# Altium schematic sheet Whitespace_Daughtercard_uhf.SchDoc: UHF 470-800 MHz Matching, PA Chain, TX/RX Switching
size D; Author: Ryan E. Guerra; Revision: 1.5; SheetNumber: 7; SheetTotal: 10
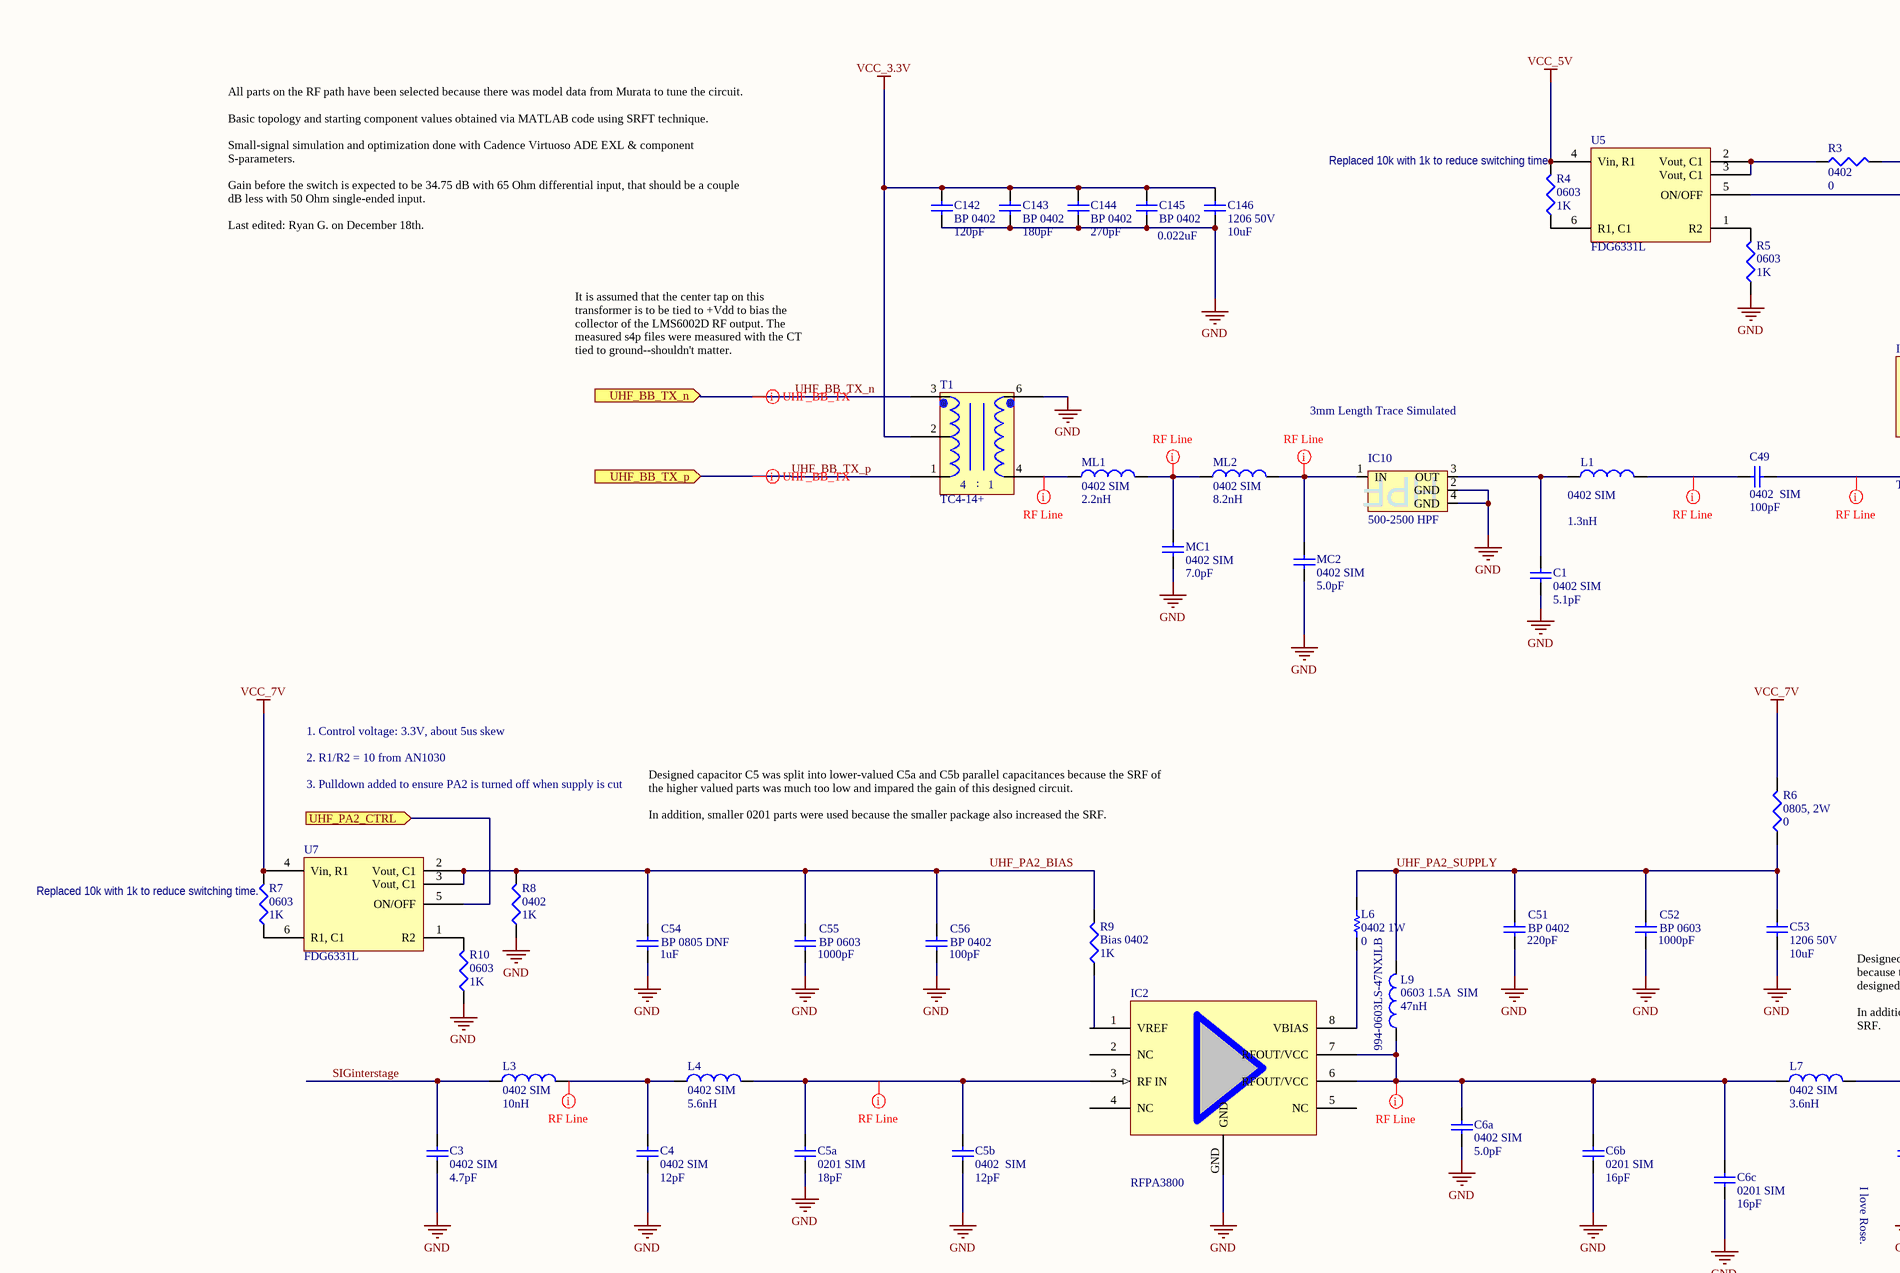
[diagram p0: Whitespace_Daughtercard_uhf.SchDoc, top left]
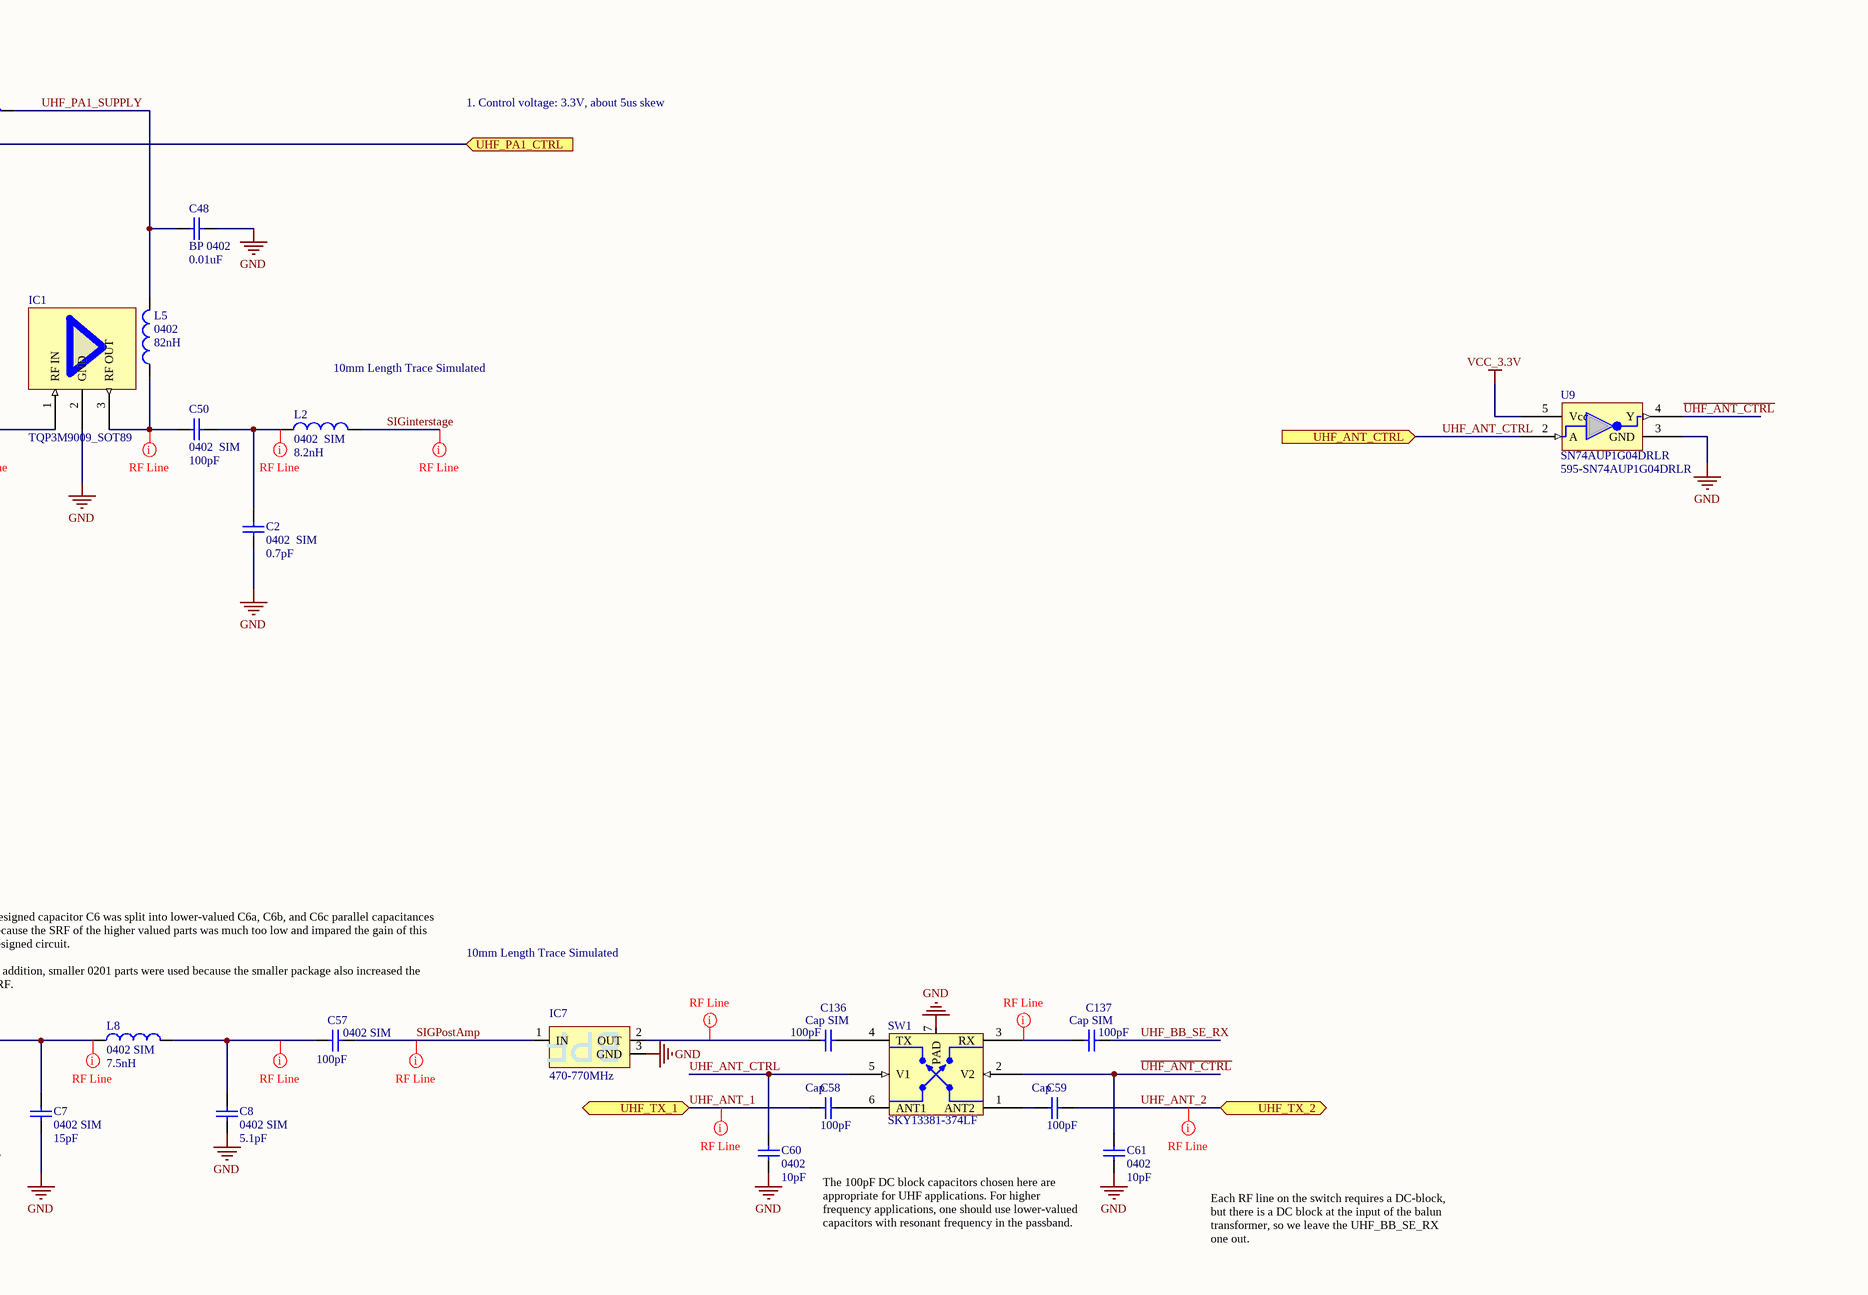
[diagram p1: Whitespace_Daughtercard_uhf.SchDoc, top right]
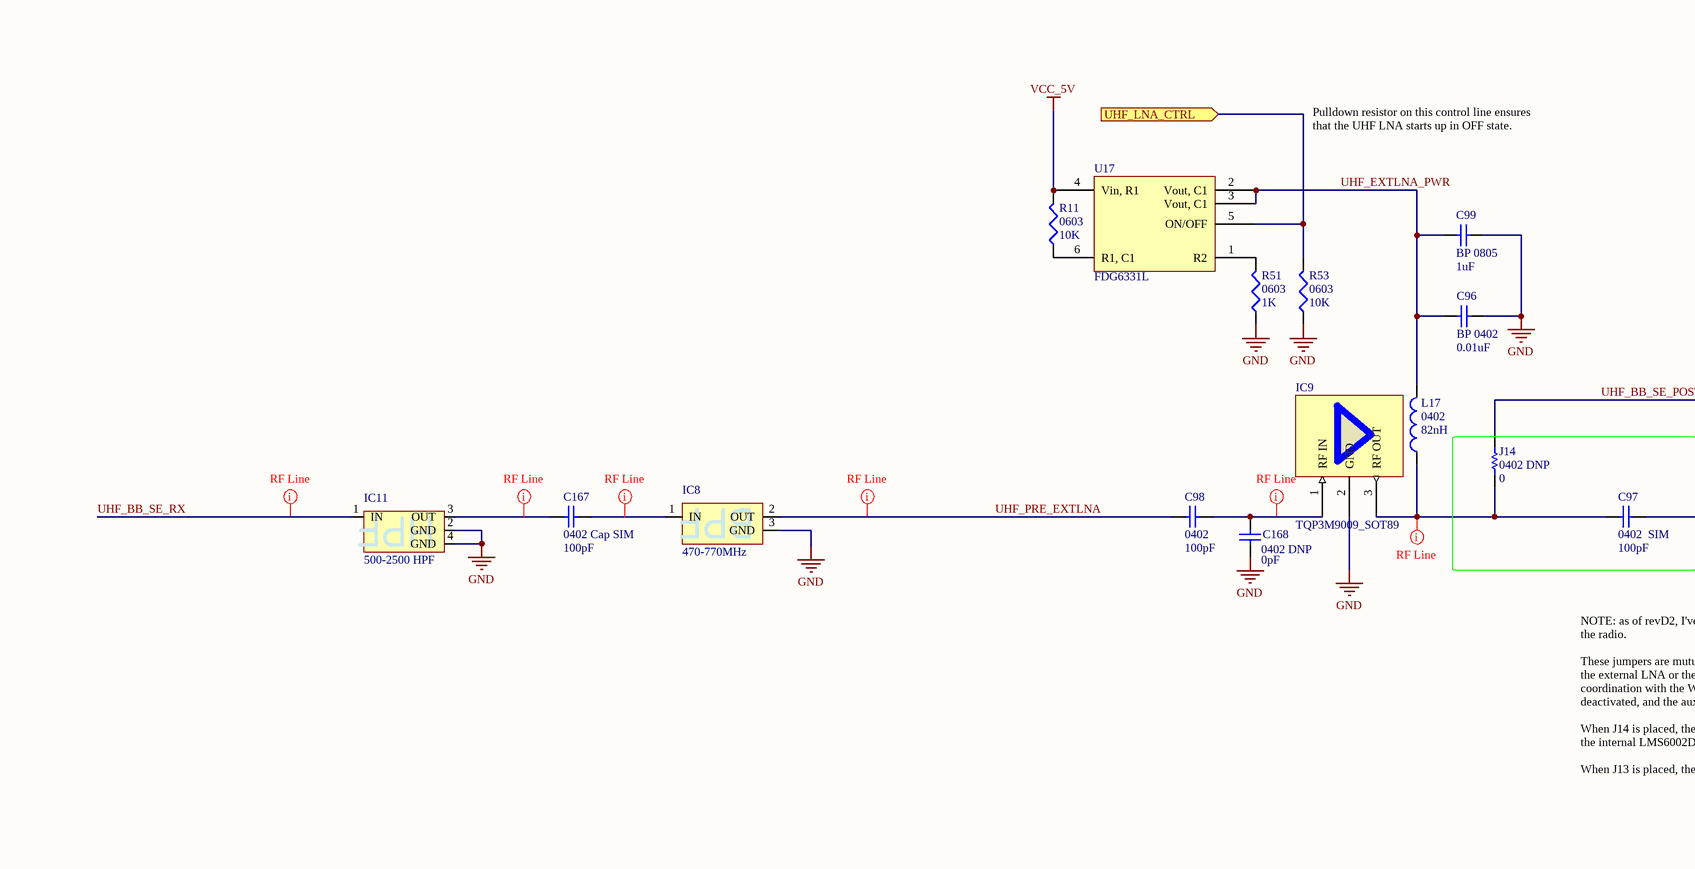
[diagram p2: Whitespace_Daughtercard_uhf.SchDoc, bottom left]
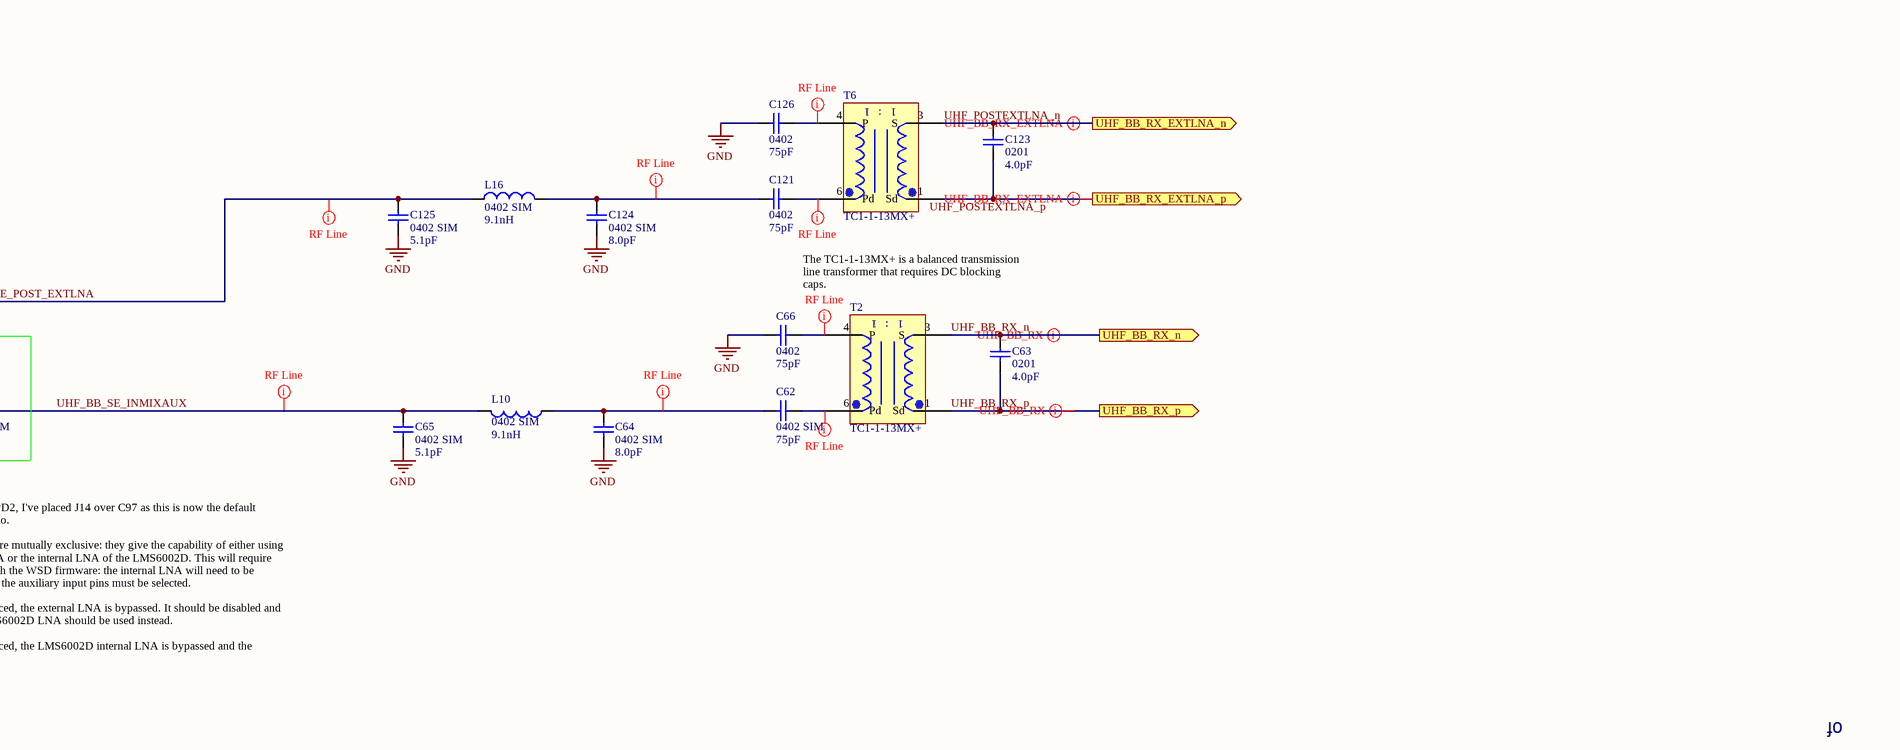
[diagram p3: Whitespace_Daughtercard_uhf.SchDoc, bottom right]

## Parts
C1  0402 SIM  value 5.1pF  [0402_SMT_V3]
C2  0402  SIM  value 0.7pF  [0402_SMT_V3]
C3  0402 SIM  value 4.7pF  [0402_SMT_V3]
C4  0402 SIM  value 12pF  [0402_SMT_V3]
C5a  0201 SIM  value 18pF  [0201_SMT_V3]
C5b  0402  SIM  value 12pF  [0402_SMT_V3]
C6a  0402 SIM  value 5.0pF  [0402_SMT_V3]
C6b  0201 SIM  value 16pF  [0201_SMT_V3]
C6c  0201 SIM  value 16pF  [0201_SMT_V3]
C7  0402 SIM  value 15pF  [0402_SMT_V3]
C8  0402 SIM  value 5.1pF  [0402_SMT_V3]
C48  BP 0402  value 0.01uF  [0402_SMT_V3]
C49  0402  SIM  value 100pF  [0402_SMT_V3]
C50  0402  SIM  value 100pF  [0402_SMT_V3]
C51  BP 0402  value 220pF  [0402_SMT_V3]
C52  BP 0603  value 1000pF  [0603_SMT_V3]
C53  1206 50V  value 10uF  [1206_SMT_v3]
C54  BP 0805 DNF  value 1uF  [0805_SMT_v3]
C55  BP 0603  value 1000pF  [0603_SMT_V3]
C56  BP 0402  value 100pF  [0402_SMT_V3]
C57  0402 SIM  value 100pF  [0402_SMT_V3]
C58  Cap  value 100pF  [0402_SMT_V3]
C59  Cap  value 100pF  [0402_SMT_V3]
C60  0402  value 10pF  [0402_SMT_v3]
C61  0402  value 10pF  [0402_SMT_v3]
C62  0402 SIM  value 75pF  [0402_SMT_v3]
C63  0201  value 4.0pF  [0201_SMT_v3]
C64  0402 SIM  value 8.0pF  [0402_SMT_v3]
C65  0402 SIM  value 5.1pF  [0402_SMT_v3]
C66  0402  value 75pF  [0402_SMT_v3]
C96  BP 0402  value 0.01uF  [0402_SMT_V3]
C97  0402  SIM  value 100pF  [0402_SMT_V3]
C98  0402  value 100pF  [0402_SMT_V3]
C99  BP 0805  value 1uF  [0805_SMT_v3]
C121  0402  value 75pF  [0402_SMT_v3]
C123  0201  value 4.0pF  [0201_SMT_v3]
C124  0402 SIM  value 8.0pF  [0402_SMT_v3]
C125  0402 SIM  value 5.1pF  [0402_SMT_v3]
C126  0402  value 75pF  [0402_SMT_v3]
C136  Cap SIM  value 100pF  [0402_SMT_V3]
C137  Cap SIM  value 100pF  [0402_SMT_V3]
C142  BP 0402  value 120pF  [0402_SMT_v3]
C143  BP 0402  value 180pF  [0402_SMT_v3]
C144  BP 0402  value 270pF  [0402_SMT_v3]
C145  BP 0402  value 0.022uF  [0402_SMT_V3]
C146  1206 50V  value 10uF  [1206_SMT_v3]
C167  0402 Cap SIM  value 100pF  [0402_SMT_V3]
C168  0402 DNP  value 0pF  [0402_SMT_v3]
IC1  TQP3M9009_SOT89  [TQP3M9009_SOT-89_v6]
IC2  RFPA3800  [RFPA3800_SOIC-8_v2]
IC7  470-770MHz  [FI168B/L Taido Yuden]
IC8  470-770MHz  [FI168B/L Taido Yuden]
IC9  TQP3M9009_SOT89  [TQP3M9009_SOT-89_v6]
IC10  500-2500 HPF  [HFCN-440+_v2]
IC11  500-2500 HPF  [HFCN-440+_v2]
J14  0402 DNP  value 0  [0402_SMT_v3]
L1  0402 SIM  value 1.3nH  [0402_SMT_V3]
L2  0402  SIM  value 8.2nH  [0402_SMT_V3]
L3  0402 SIM  value 10nH  [0402_SMT_V3]
L4  0402 SIM  value 5.6nH  [0402_SMT_V3]
L5  0402  value 82nH  [0402_SMT_V3]
L6  0402 1W  value 0  [0402_SMT_v3]
L7  0402 SIM  value 3.6nH  [0402_SMT_V3]
L8  0402 SIM  value 7.5nH  [0402_SMT_V3]
L9  0603 1.5A  SIM  value 47nH  Supplier Part Number 1: 994-0603LS-47NXJLB  [0603_SMT_v3]
L10  0402 SIM  value 9.1nH  [0402_SMT_v3]
L16  0402 SIM  value 9.1nH  [0402_SMT_v3]
L17  0402  value 82nH  [0402_SMT_V3]
MC1  0402 SIM  value 7.0pF  [0402_SMT_V3]
MC2  0402 SIM  value 5.0pF  [0402_SMT_V3]
ML1  0402 SIM  value 2.2nH  [0402_SMT_V3]
ML2  0402 SIM  value 8.2nH  [0402_SMT_V3]
R3  0402  value 0  [0402_SMT_V3]
R4  0603  value 1K  [0603_SMT_v3]
R5  0603  value 1K  [0603_SMT_v3]
R6  0805, 2W  value 0  [0805_SMT_v3]
R7  0603  value 1K  [0603_SMT_v3]
R8  0402  value 1K  [0402_SMT_V3]
R9  Bias 0402  value 1K  [0402_SMT_V3]
R10  0603  value 1K  [0603_SMT_v3]
R11  0603  value 10K  [0603_SMT_v3]
R51  0603  value 1K  [0603_SMT_v3]
R53  0603  value 10K  [0603_SMT_v3]
SW1  SKY13381-374LF  [SKY13381-374LF_v6]
T1  TC4-14+  [AT224-1_V2]
T2  TC1-1-13MX+  [AT1521_MiniCircuits]
T6  TC1-1-13MX+  [AT1521_MiniCircuits]
U5  FDG6331L  [SC-70-6]
U7  FDG6331L  [SC-70-6]
U9  SN74AUP1G04DRLR  Supplier Part Number 1: 595-SN74AUP1G04DRLR  [DRL_R-PDSO-N5_v2]
U17  FDG6331L  [SC-70-6]

## Ports
UHF_ANT_CTRL (in), UHF_BB_RX_EXTLNA_n (out), UHF_BB_RX_EXTLNA_p (out), UHF_BB_RX_n (out), UHF_BB_RX_p (out), UHF_BB_TX_n (in), UHF_BB_TX_p (in), UHF_LNA_CTRL (in), UHF_PA1_CTRL (in), UHF_PA2_CTRL (in), UHF_TX_1 (bidir), UHF_TX_2 (bidir)

## Nets
GND: C1.1 C2.1 C3.1 C4.1 C5a.1 C5b.1 C6a.1 C6b.1 C6c.1 C7.1 C8.1 C48.2 C51.1 C52.1 C53.2 C54.1 C55.1 C56.1 C60.1 C61.1 C64.1 C65.2 C66.2 C96.2 C99.1 C124.1 C125.1 C126.2 C142.1 C143.2 C144.2 C145.1 C146.1 C168.1 IC1.2(GND) IC2.GND IC7.3(GND) IC8.3(GND) IC9.2(GND) IC10.2(GND) IC10.4(GND) IC11.2(GND) IC11.4(GND) MC1.1 MC2.1 R5.1 R8.1 R10.1 R51.1 R53.1 SW1.7(PAD) T1.6(P_DOT) U9.3(GND)
VCC_3.3V: C142.2 C143.1 C144.1 C145.2 C146.2 T1.2(S_CT) U9.5(Vcc)
VCC_5V: R4.2 R11.2 U5.4(Vin,_R1) U17.4(Vin,_R1)
VCC_7V: R6.2 R7.2 U7.4(Vin,_R1)
~{UHF_ANT_CTRL}: C61.2 SW1.2(V2) U9.4(Y)
SIGinterstage: C3.2 L2.2 L3.1
SIGPostAmp: C57.2 IC7.1(IN)
UHF_ANT_1: C58.2 ; port UHF_TX_1
UHF_ANT_2: C59.1 ; port UHF_TX_2
UHF_ANT_CTRL: C60.2 SW1.5(V1) U9.2(A) ; port UHF_ANT_CTRL
UHF_BB_RX_n: C63.1 T2.3(S) ; port UHF_BB_RX_n
UHF_BB_RX_p: C63.2 T2.1(Sd) ; port UHF_BB_RX_p
UHF_BB_SE_INMIXAUX: C65.1 C97.1 L10.2
UHF_BB_SE_POST_EXTLNA: C125.2 J14.2 L16.1
UHF_BB_SE_RX: C137.1 IC11.1(IN)
UHF_BB_TX_n: T1.3(S_DOT) ; port UHF_BB_TX_n
UHF_BB_TX_p: T1.1(S) ; port UHF_BB_TX_p
UHF_EXTLNA_PWR: C96.1 C99.2 L17.2 U17.2(Vout,_C1) U17.3(Vout,_C1)
UHF_LNA_CTRL: R53.2 U17.5(ON/OFF) ; port UHF_LNA_CTRL
UHF_PA1_CTRL: U5.5(ON/OFF) ; port UHF_PA1_CTRL
UHF_PA1_SUPPLY: C48.1 L5.2 R3.2
UHF_PA2_BIAS: C54.2 C55.2 C56.2 R8.2 R9.2 U7.2(Vout,_C1) U7.3(Vout,_C1)
UHF_PA2_CTRL: U7.5(ON/OFF) ; port UHF_PA2_CTRL
UHF_PA2_SUPPLY: C51.2 C52.2 C53.1 L6.2 L9.2 R6.1
UHF_POSTEXTLNA_n: C123.1 T6.3(S) ; port UHF_BB_RX_EXTLNA_n
UHF_POSTEXTLNA_p: C123.2 T6.1(Sd) ; port UHF_BB_RX_EXTLNA_p
UHF_PRE_EXTLNA: C98.2 IC8.2(OUT)
NetC1_2: C1.2 IC10.3(OUT) L1.1
NetC2_2: C2.2 C50.2 L2.1
NetC4_2: C4.2 L3.2 L4.1
NetC5a_2: C5a.2 C5b.2 IC2.3(RF_IN) L4.2
NetC6a_2: C6a.2 C6b.2 C6c.2 IC2.6(RFOUT/VCC) IC2.7(RFOUT/VCC) L7.1 L9.1
NetC7_2: C7.2 L7.2 L8.1
NetC8_2: C8.2 C57.1 L8.2
NetC49_1: C49.1 L1.2
NetC49_2: C49.2 IC1.1(RF_IN)
NetC50_1: C50.1 IC1.3(RF_OUT) L5.1
NetC58_1: C58.1 SW1.6(ANT1)
NetC59_2: C59.2 SW1.1(ANT2)
NetC62_1: C62.1 T2.6(Pd)
NetC62_2: C62.2 C64.2 L10.1
NetC66_1: C66.1 T2.4(P)
NetC97_2: C97.2 IC9.3(RF_OUT) J14.1 L17.1
NetC98_1: C98.1 C168.2 IC9.1(RF_IN)
NetC121_1: C121.1 T6.6(Pd)
NetC121_2: C121.2 C124.2 L16.2
NetC126_1: C126.1 T6.4(P)
NetC136_1: C136.1 SW1.4(TX)
NetC136_2: C136.2 IC7.2(OUT)
NetC137_2: C137.2 SW1.3(RX)
NetC167_1: C167.1 IC11.3(OUT)
NetC167_2: C167.2 IC8.1(IN)
NetIC2_1: IC2.1(VREF) R9.1
NetIC2_8: IC2.8(VBIAS) L6.1
NetIC10_1: IC10.1(IN) MC2.2 ML2.2
NetMC1_2: MC1.2 ML1.2 ML2.1
NetML1_1: ML1.1 T1.4(P)
NetR3_1: R3.1 U5.2(Vout,_C1) U5.3(Vout,_C1)
NetR4_1: R4.1 U5.6(R1,_C1)
NetR5_2: R5.2 U5.1(R2)
NetR7_1: R7.1 U7.6(R1,_C1)
NetR10_2: R10.2 U7.1(R2)
NetR11_1: R11.1 U17.6(R1,_C1)
NetR51_2: R51.2 U17.1(R2)

Not connected (* = marked no-connect by the designer): IC2 2(NC) 4(NC) 5(NC)

## Layout directives
differential pair: UHF_BB_RX_n, UHF_BB_RX_p, UHF_BB_TX_n, UHF_BB_TX_p, UHF_POSTEXTLNA_n, UHF_POSTEXTLNA_p
rule Impedance Constraint [Min = 49.00    Max = 51.00    ]; net class RF: NetC2_2, NetC4_2, NetC5a_2, NetC6a_2, NetC7_2, NetC8_2, NetC49_1, NetC49_2, NetC50_1, NetC62_1, NetC62_2, NetC66_1, NetC97_2, NetC98_1, NetC121_1, NetC121_2, NetC126_1, NetC136_2, NetC137_2, NetC167_1, NetC167_2, NetIC10_1, NetMC1_2, NetML1_1, SIGinterstage, SIGPostAmp, UHF_ANT_1, UHF_ANT_2, UHF_BB_SE_INMIXAUX, UHF_BB_SE_POST_EXTLNA, UHF_BB_SE_RX, UHF_PRE_EXTLNA

## Notes on the sheet
- (near U5) Replaced 10k with 1k to reduce switching time.
- 1. Control voltage: 3.3V, about 5us skew
- All parts on the RF path have been selected because there was model data from Murata to tune the circuit.
  Basic topology and starting component values obtained via MATLAB code using SRFT technique.
  Small-signal simulation and optimization done with Cadence Virtuoso ADE EXL & component S-parameters.
  Gain before the switch is expected to be 34.75 dB with 65 Ohm differential input, that should be a couple dB less with 50 Ohm single-ended input.
  Last edited: Ryan G. on December 18th.
- It is assumed that the center tap on this transformer is to be tied to +Vdd to bias the collector of the LMS6002D RF output. The measured s4p files were measured with the CT tied to ground--shouldn't matter.
- 3mm Length Trace Simulated
- (near L2) 10mm Length Trace Simulated
- 2. R1/R2 = 10 from AN1030
- 3. Pulldown added to ensure PA2 is turned off when supply is cut
- Designed capacitor C5 was split into lower-valued C5a and C5b parallel capacitances because the SRF of the higher valued parts was much too low and impared the gain of this designed circuit.
  In addition, smaller 0201 parts were used because the smaller package also increased the SRF.
- Replaced 10k with 1k to reduce switching time.
- 10mm Length Trace Simulated
- Designed capacitor C6 was split into lower-valued C6a, C6b, and C6c parallel capacitances because the SRF of the higher valued parts was much too low and impared the gain of this designed circuit.
  In addition, smaller 0201 parts were used because the smaller package also increased the SRF.
- (near C7) I love Rose.
- (near C61) The 100pF DC block capacitors chosen here are appropriate for UHF applications. For higher frequency applications, one should use lower-valued capacitors with resonant frequency in the passband.
- Each RF line on the switch requires a DC-block, but there is a DC block at the input of the balun transformer, so we leave the UHF_BB_SE_RX one out.
- Pulldown resistor on this control line ensures that the UHF LNA starts up in OFF state.
- The TC1-1-13MX+ is a balanced transmission line transformer that requires DC blocking caps.
- NOTE: as of revD2, I've placed J14 over C97 as this is now the default mode of the radio.
  These jumpers are mutually exclusive: they give the capability of either using the external LNA or the internal LNA of the LMS6002D. This will require coordination with the WSD firmware: the internal LNA will need to be deactivated, and the auxiliary input pins must be selected.
  When J14 is placed, the external LNA is bypassed. It should be disabled and the internal LMS6002D LNA should be used instead.
  When J13 is placed, the LMS6002D internal LNA is bypassed and the external LNA should be enabled by bringing PB5 on the Stellaris high.
- of
- (in symbol FI168L062005-T) BPF
- (in symbol HFCN-440+) HPF
- (in symbol TC1-1-13MX+) :
- (in symbol TC4-14+) :

## Library data of the parts
C1-C4 C5a C5b C6a C6b C6c C7 C8 C60-C66 C121 C123-C126 MC2 = Cap Semi: Capacitor (Semiconductor SIM Model); Published: 8-Jun-2000; LatestRevisionDate: 29-May-2009; LatestRevisionNote: IPC-7351 Footprint Added.; PackageReference: C1206; Publisher: Altium Limited; PackageDescription: Chip Capacitor; Supplier 1: Mouser
  C1 C8 C65 C125: Supplier Part Number 1: 81-GRM1555C1H5R1WA1D
  C2: Supplier Part Number 1: 81-GRM1555C1HR70WA1D
  C3: Supplier Part Number 1: 81-GRM1555C1H4R7WA1D
  C4 C5b: Supplier Part Number 1: 81-GJM1555C1H120FB1D
  C5a: Supplier Part Number 1: 81-GRM0335C1H180GA1D
  C6a: Supplier Part Number 1: 81-GJM1555C1H5R0BB01
  C6b C6c: Supplier Part Number 1: 81-GRM0335C1H160GA1D
  C7: Supplier Part Number 1: 81-GJM1555C1H150GB01
  C60 C61: Supplier Part Number 1: 81-GRM1555C1H100JA1D
  C62 C66 C121 C126: Supplier Part Number 1: 81-GRM1555C1H750GZ1D
  C63 C123: Supplier Part Number 1: 81-GRM0335C1H4R0CD1D
  C64 C124: Supplier Part Number 1: 81-GRM1555C1H8R0BZ1D
  MC2: Supplier Part Number 1: 81-GRM1555C1H5R0WA1D
C48-C59 C96-C99 C136 C137 C142-C146 C167 MC1 = Cap: Capacitor; Published: 8-Jun-2000; LatestRevisionDate: 17-Jul-2002; LatestRevisionNote: Re-released for DXP Platform.; PackageReference: RAD-0.3; Publisher: Altium Limited; PackageDescription: Radial Cap, Thru-Hole; 2 Leads; 0.3 in Pin Spacing; Supplier 1: Mouser
  C48 C96: Supplier Part Number 1: 81-GRM155R71H103KA8D
  C49 C50 C56-C59 C97 C98 C136 C137 C167: Supplier Part Number 1: 81-GRM1555C1H101GA1D
  C51: Supplier Part Number 1: 81-GRM1555C1H221GA1J
  C52 C55: Supplier Part Number 1: 81-GRM39X102J50D
  C53 C146: Supplier Part Number 1: 81-GRM31CR61H106KA2L
  C54 C99: Supplier Part Number 1: 81-GRM21BR71H105KA2L
  C142: Supplier Part Number 1: 81-GRM1555C1H121GA1D
  C143: Supplier Part Number 1: 81-GRM1555C1H181GA1D
  C144: Supplier Part Number 1: 81-GRM155C1H271JA01D
  C145: Supplier Part Number 1: 81-GRM155R71H223KA2J
  MC1: Supplier Part Number 1: 81-GRM1555C1H7R0WA1D
C168 = Cap_0402: 0402 SMT Cap
IC1 IC9 = TQP3M9009_SOT89: Triquint TQP3M9009 Power Amplifier; Supplier 1: Mouser; Supplier Part Number 1: 772-TQP3M9009
IC2 = RFPA3800: RFMD RFPA3800 Power Amplifier
IC7 IC8 = FI168L062005-T: Supplier 1: Mouser; Supplier Part Number 1: 963-FI168L062005-T
IC10 IC11 = HFCN-440+: Mini-Circuits High-Pass 500-2500 MHz Filter SMT
J14 L6 = Res_0402: 0402 SMT Resistor; Supplier Part Number 1: 660-RK73Z1ETTP; Supplier 1: Mouser
L1-L5 L7-L10 L16 L17 ML1 ML2 = Inductor: Code_IEC: 1005; Published: 8-Jun-2000; LatestRevisionDate: 29-May-2009; LatestRevisionNote: IPC-7351 Footprint Added.; PackageReference: 0402-A; Publisher: Altium Limited; PackageDescription: Chip Inductor; Code_JEITA: 0402; Supplier 1: Mouser
  L1: Supplier Part Number 1: 81-LQP15MN1N3W02D
  L2 ML2: Supplier Part Number 1: 81-LQP15MN8N2B02D
  L3: Supplier Part Number 1: 81-LQP15MN10NG02D
  L4: Supplier Part Number 1: 81-LQP15MN5N6B02D
  L5 L17: Supplier Part Number 1: 81-LQW15AN82NJ00D
  L7: Supplier Part Number 1: 81-LQP15MN3N6W02D
  L8: Supplier Part Number 1: 81-LQP15MN7N5B02D
  L10 L16: Supplier Part Number 1: 81-LQP15MN9N1B02D
  ML1: Supplier Part Number 1: 81-LQP15MN2N2W02D
R3-R11 R51 R53 = Res3: Resistor; Published: 8-Jun-2000; LatestRevisionDate: 29-May-2009; LatestRevisionNote: IPC-7351 Footprint Added.; PackageReference: J1-0603; Publisher: Altium Limited; PackageDescription: Chip Resistor; Supplier 1: Mouser
  R3: Supplier Part Number 1: 660-RK73Z1ETTP
  R4 R5 R7 R10 R51: Supplier Part Number 1: 71-CRCW0603J-1.0K
  R6: Supplier Part Number 1: 660-RK73Z2ATTED
  R8 R9: Supplier Part Number 1: 754-RR0510P-102D
  R11 R53: Supplier Part Number 1: 71-CRCW0603J-10K
SW1 = SKY13381-374LF: GaAs pHEMT DPDT switch 0.1-6.0 GHz; Supplier 1: Mouser; Supplier Part Number 1: 873-SKY13381-374LF
T1 = TC4-14+: Mini-Circuits Type A Transformer, 4:1 Ohm, CT, 200-1400MHz; Manufacturer: Mini-Circuits; Supplier 1: Mini-Circuits; Supplier Part Number 1: TC4-14X+
T2 T6 = TC1-1-13MX+: Mini-Circuits Type G 4.5-3000MHz 1:1 Transformer
U5 U7 U17 = FDG6331L: Integrated Load Switch, 0.8A, 2.5-8V, SC70-6; Supplier 1: Mouser; Supplier Part Number 1: 512-FDG6331L
U9 = SN74AUP1G04DRLR: Inverters Lo Pwr Sngl Invter Gate; Supplier 1: Mouser